# EAGLE design KEY_1_0 (EAGLE 7.6.0)
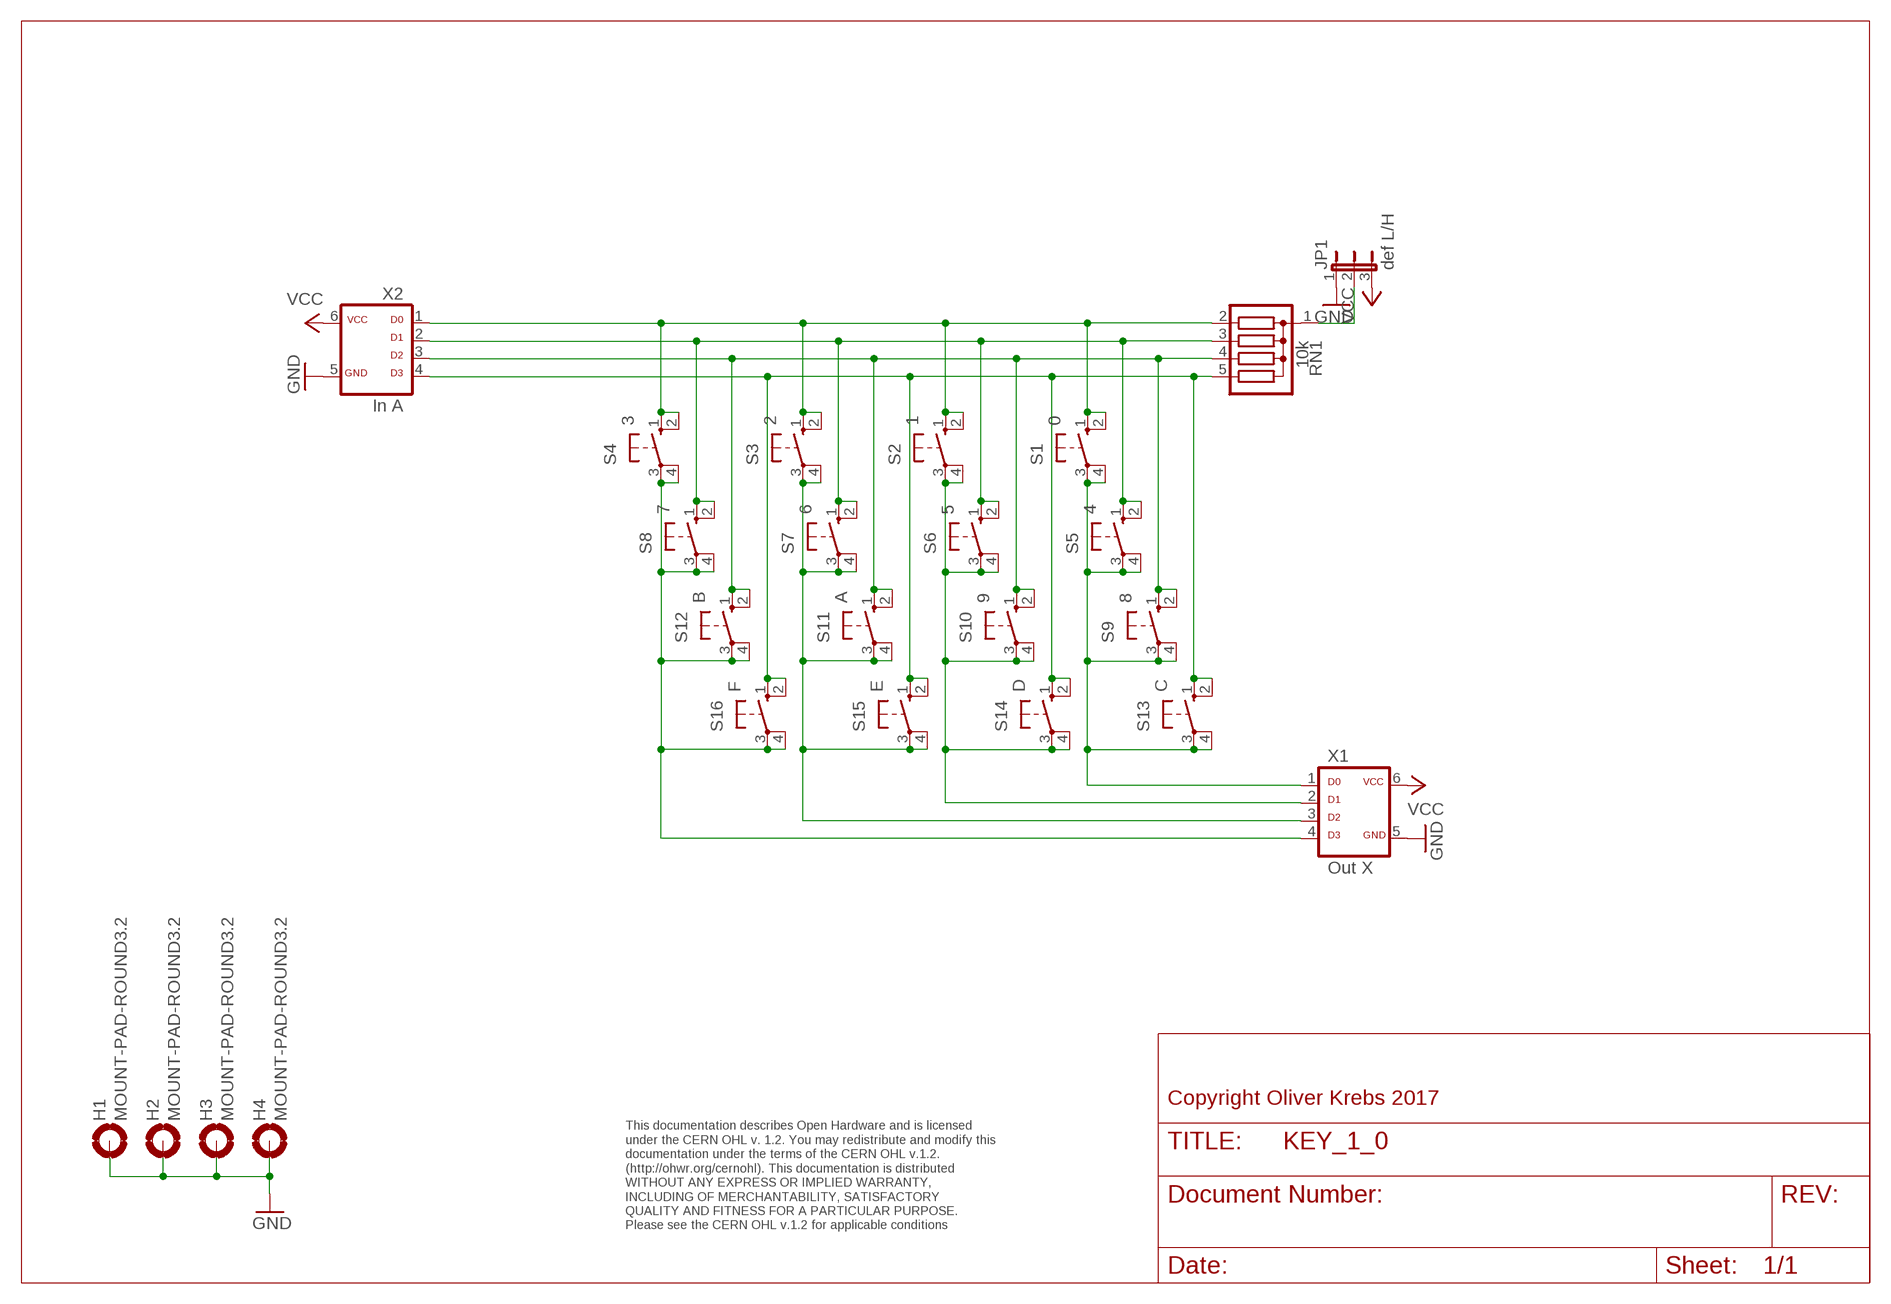
[diagram p0: schematic, sheet 1]

## Parts
H1  MOUNT-PAD-ROUND3.2  [3,2-PAD]
H2  MOUNT-PAD-ROUND3.2  [3,2-PAD]
H3  MOUNT-PAD-ROUND3.2  [3,2-PAD]
H4  MOUNT-PAD-ROUND3.2  [3,2-PAD]
JP1  def L/H  JP2EJP2-U  [JP2-U]
RN1  10k  G04R  [SIL5]
S1  0  10-XX  [B3F-10XX]
S2  1  10-XX  [B3F-10XX]
S3  2  10-XX  [B3F-10XX]
S4  3  10-XX  [B3F-10XX]
S5  4  10-XX  [B3F-10XX]
S6  5  10-XX  [B3F-10XX]
S7  6  10-XX  [B3F-10XX]
S8  7  10-XX  [B3F-10XX]
S9  8  10-XX  [B3F-10XX]
S10  9  10-XX  [B3F-10XX]
S11  A  10-XX  [B3F-10XX]
S12  B  10-XX  [B3F-10XX]
S13  C  10-XX  [B3F-10XX]
S14  D  10-XX  [B3F-10XX]
S15  E  10-XX  [B3F-10XX]
S16  F  10-XX  [B3F-10XX]
X1  Out X  ML6D  [ML-6]
X2  In A  ML6D  [ML-6]

## Nets
GND: H1.B3,2(MOUNT) H2.B3,2(MOUNT) H3.B3,2(MOUNT) H4.B3,2(MOUNT) JP1.1 X1.5 X2.5
N$1: JP1.2 RN1.1
N$3: RN1.4 S9.1(S) S9.2(S1) S10.1(S) S10.2(S1) S11.1(S) S11.2(S1) S12.1(S) S12.2(S1) X2.3
N$4: RN1.5 S13.1(S) S13.2(S1) S14.1(S) S14.2(S1) S15.1(S) S15.2(S1) S16.1(S) S16.2(S1) X2.4
N$5: RN1.2 S1.1(S) S1.2(S1) S2.1(S) S2.2(S1) S3.1(S) S3.2(S1) S4.1(S) S4.2(S1) X2.1
N$6: RN1.3 S5.1(S) S5.2(S1) S6.1(S) S6.2(S1) S7.1(S) S7.2(S1) S8.1(S) S8.2(S1) X2.2
N$8: S2.3(P) S2.4(P1) S6.3(P) S6.4(P1) S10.3(P) S10.4(P1) S14.3(P) S14.4(P1) X1.2
N$9: S1.3(P) S1.4(P1) S5.3(P) S5.4(P1) S9.3(P) S9.4(P1) S13.3(P) S13.4(P1) X1.1
N$12: S4.3(P) S4.4(P1) S8.3(P) S8.4(P1) S12.3(P) S12.4(P1) S16.3(P) S16.4(P1) X1.4
N$15: S3.3(P) S3.4(P1) S7.3(P) S7.4(P1) S11.3(P) S11.4(P1) S15.3(P) S15.4(P1) X1.3
VCC: JP1.3 X1.6 X2.6

## Notes on the sheet
- Copyright Oliver Krebs 2017
- This documentation describes Open Hardware and is licensed 
  under the CERN OHL v. 1.2. You may redistribute and modify this 
  documentation under the terms of the CERN OHL v.1.2. 
  (http://ohwr.org/cernohl). This documentation is distributed
  WITHOUT ANY EXPRESS OR IMPLIED WARRANTY, 
  INCLUDING OF MERCHANTABILITY, SATISFACTORY 
  QUALITY AND FITNESS FOR A PARTICULAR PURPOSE. 
  Please see the CERN OHL v.1.2 for applicable conditions

## Library data of the parts
H1-H4 = holes:MOUNT-PAD-ROUND: MOUNTING PAD, round
JP1 = 01-my-jumper:JP2E: JUMPER
RN1 = resistor-sil:G04R: SIL RESISTOR; OC_FARNELL: unknown; OC_NEWARK: unknown
S1-S16 = switch-omron:10-XX: OMRON SWITCH; MPN: B3F-1000; OC_FARNELL: 176432; OC_NEWARK: 36M3542
X1 X2 = 01-my-con:ML6D

## Board
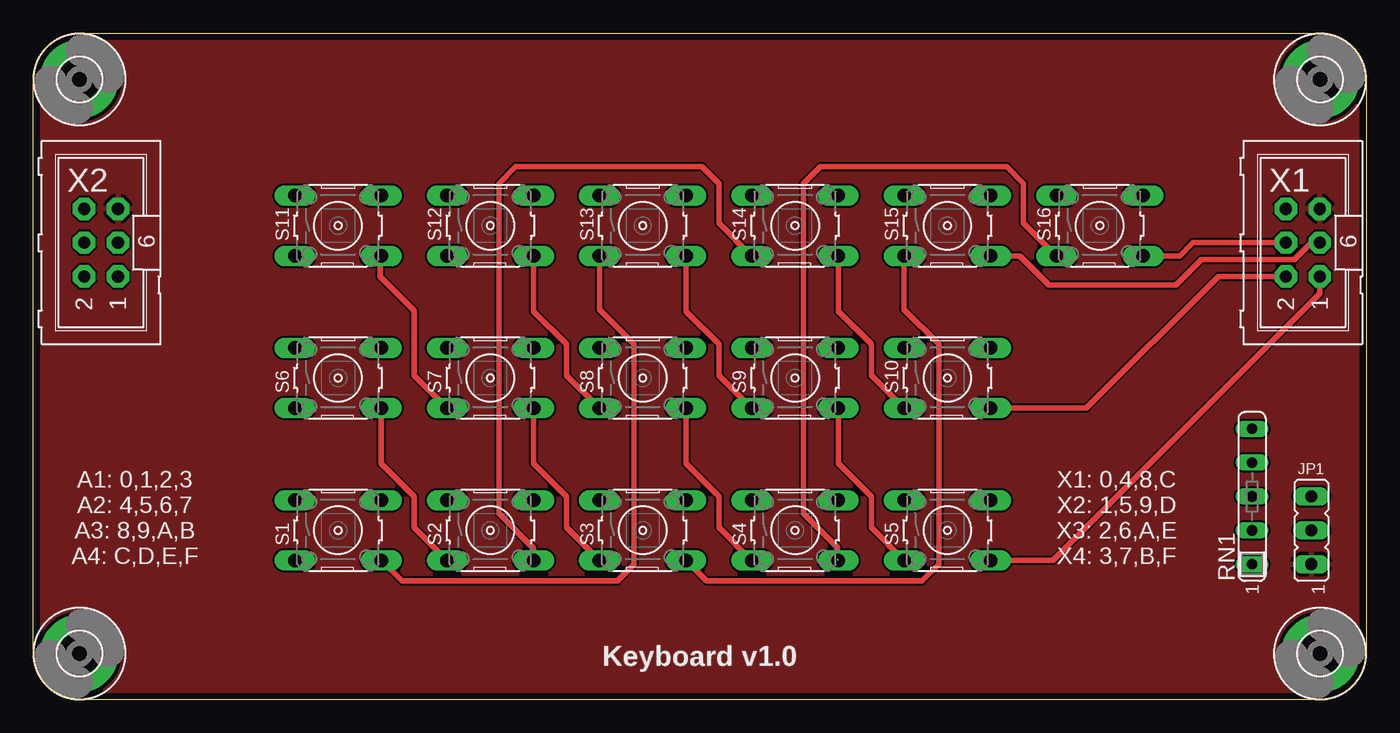
[diagram p1: board, top side]
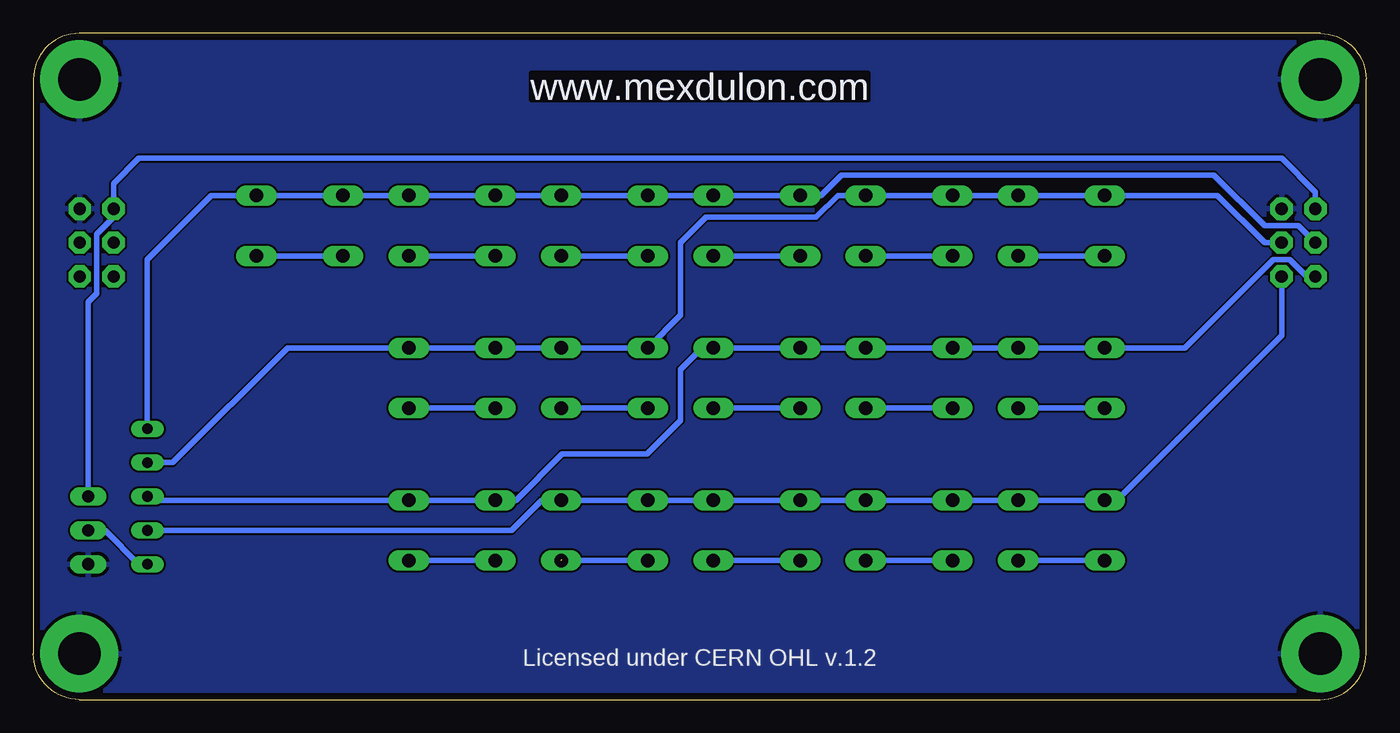
[diagram p2: board, bottom side, seen from below]

Size 100 x 50 mm. Coordinates in mm from the lower left corner, seen from the top.
Outline: 0,3.45 0,46.55 arc-90 3.45,50 96.55,50 arc-90 100,46.55 100,3.45 arc-90 96.55,0 3.45,0 arc-90 0,3.45
Copper layers (1*16): Top 0.035mm / dielectric 1.6mm / Bottom 0.035mm
Design rules "Elecrow_2-layer_PCB_eagle_rule": minimum track width 6mil, minimum drill 12mil, track to track 6mil, track to pad 6mil, pad to pad 6mil, via to via 8mil, smd to smd 0mil, copper to edge 20mil, drill to drill 10mil, minimum pad ring 6mil, minimum via ring 6mil, stop-mask expansion 0mil, vias tented up to drill 100mil, thermal gap 10mil

### Footprints (pad centres in the part's own frame; a part is rotated, then mirrored left to right if it is on the bottom)
3,2-PAD = drill 3.2 pad 5.842: B3,2 0,0
JP2-U = drill 0.914 long: 1 -2.54,0; 2 0,0; 3 2.54,0
SIL5 = drill 0.813 long: 1 -5.08,0; 2 -2.54,0; 3 0,0; 4 2.54,0; 5 5.08,0
B3F-10XX = drill 1.016 long: 1 -3.251,2.261; 2 3.251,2.261; 3 -3.251,-2.261; 4 3.251,-2.261
ML-6 = drill 0.914 pad 1.676 octagon: 1 -2.54,-1.27; 2 -2.54,1.27; 3 0,-1.27; 4 0,1.27; 5 2.54,-1.27; 6 2.54,1.27

### Placement (x,y rotation side)
H1  3.45,3.45 0 top
H2  3.45,46.55 0 top
H3  96.55,3.45 0 top
H4  96.55,46.55 0 top
JP1  95.89,12.7 90 top
RN1  91.44,15.24 90 top
S1  22.86,12.7 0 top
S2  34.29,12.7 0 top
S3  45.72,12.7 0 top
S4  57.15,12.7 0 top
S5  68.58,12.7 0 top
S6  22.86,24.13 0 top
S7  34.29,24.13 0 top
S8  45.72,24.13 0 top
S9  57.15,24.13 0 top
S10  68.58,24.13 0 top
S11  22.86,35.56 0 top
S12  34.29,35.56 0 top
S13  45.72,35.56 0 top
S14  57.15,35.56 0 top
S15  68.58,35.56 0 top
S16  80.01,35.56 0 top
X1  95.25,34.29 90 top
X2  5.08,34.29 90 top

### Tracks (layer width: path | path; a pad name or v marks a point on that pad's centre or on a via)
GND
  pour Bottom: 0,0 100.8,0 100.8,50.8 0,50.8
  pour Top: 0,50.16 100.17,50.16 100.17,0 0,0
N$1
  Bottom 0.406: JP1.2 94.61,12.7 92.08,10.16 RN1.1
N$3
  Bottom 0.406: X2.3 7.62,34.29 11.15,37.82 S11.1 S11.2 S12.1 S12.2 39.65,37.82 41.27,36.2 49.53,36.2 51.44,34.29 51.44,28.85 S9.1 S9.2 S10.1 S10.2 80.92,26.39 89.53,17.78 RN1.4
N$4
  Bottom 0.406: X2.4 5.08,35.56 7.62,35.56 11.43,39.37 39.37,39.37 40.92,37.82 S13.1 S13.2 S14.1 S14.2 S15.1 S15.2 S16.1 S16.2 86.64,37.82 91.44,33.02 RN1.5
N$5
  Bottom 0.406: X2.1 6.35,27.3 18.69,14.96 S1.1 S1.2 S2.1 S2.2 S3.1 S3.2 S4.1 S4.2 61.87,14.96 64.14,12.7 RN1.2
N$6
  Bottom 0.406: X2.2 4.45,31.75 5.71,33.02 6.99,33.02 13.61,26.39 S6.1 S6.2 S7.1 S7.2 S8.1 S8.2 49.33,26.04 50.16,26.04 51.44,24.77 51.44,20.95 53.98,18.41 60.33,18.41 63.78,14.96 S5.1 S5.2 90.53,14.96 90.81,15.24 RN1.3
N$8
  Top 0.406: S14.4 60.4,29.13 62.87,26.67 62.87,24.33 S10.3 | S6.4 26.11,17.7 28.57,15.24 28.57,12.9 S2.3 | S10.4 79.02,21.87 88.9,31.75 X1.2 | S2.4 37.54,11.35 34.92,13.97 34.92,38.73 36.2,40.01 50.16,40.01 51.44,38.73 51.44,35.76 S14.3
  Bottom 0.406: S10.3 S10.4 | S14.4 S14.3 | S6.3 S6.4 | S2.4 S2.3
N$9
  Top 0.406: S13.4 48.97,29.13 51.44,26.67 51.44,24.33 S9.3 | S9.4 60.4,17.7 62.87,15.24 62.87,12.9 S5.3 | S5.4 76.48,10.44 96.52,30.48 X1.1 | S13.3 42.47,29.29 45.09,26.67 45.09,10.16 43.81,8.89 27.66,8.89 S1.4
  Bottom 0.406: S9.3 S9.4 | S13.4 S13.3 | S5.4 S5.3 | S1.4 S1.3
N$12  (1 unrouted)
  Top 0.406: S12.4 37.54,29.13 40.01,26.67 40.01,24.33 S8.3 | S8.4 48.97,17.7 51.44,15.24 51.44,12.9 S4.3 | S16.4 86,33.3 87,34.29 X1.4 | S16.3 74.3,35.76 74.3,38.73 73.03,40.01 59.05,40.01 57.78,38.73 57.78,13.97 60.33,11.43 60.33,10.52
  Bottom 0.406: S8.3 S8.4 | S16.3 S16.4 | S12.4 S12.3 | S4.4 S4.3
N$15
  Top 0.406: S11.4 26.04,33.22 26.04,31.75 28.57,29.21 28.57,24.33 S7.3 | S7.4 37.54,17.7 40.01,15.24 40.01,12.9 S3.3 | S15.3 65.33,29.29 67.94,26.67 67.94,10.16 66.67,8.89 50.52,8.89 S3.4 | S15.4 74.02,33.3 76.2,31.11 85.72,31.11 87.63,33.02 94.61,33.02 95.89,34.29 X1.3
  Bottom 0.406: S11.3 S11.4 | S7.3 S7.4 | S15.3 S15.4 | S3.4 S3.3
VCC
  Bottom 0.406: X2.6 3.81,38.1 6.35,40.64 92.08,40.64 93.98,38.73 X1.6 93.98,36.2 95.25,34.92 95.25,30.48 95.89,29.84 JP1.3

### Text on the board
Bottom: www.mexdulon.com
tNames: A1: 0,1,2,3 / A2: 4,5,6,7 / A3: 8,9,A,B / A4: C,D,E,F | X1: 0,4,8,C / X2: 1,5,9,D / X3: 2,6,A,E / X4: 3,7,B,F | Keyboard v1.0
bNames: www.mexdulon.com | Licensed under CERN OHL v.1.2